# EasyEDA Pro project Dragon_Ball_Radar_3.eprj

# Schematic Schematic1

## Sheets
1 P1: Create Date: 2024-03-10; Page Name: P1; Project Name: Dragon_Ball_Radar_3; Schematic Name: Schematic1; Update Date: 2024-05-07; Company: 嘉立创EDA; Page Size: A4; Version: V1.0
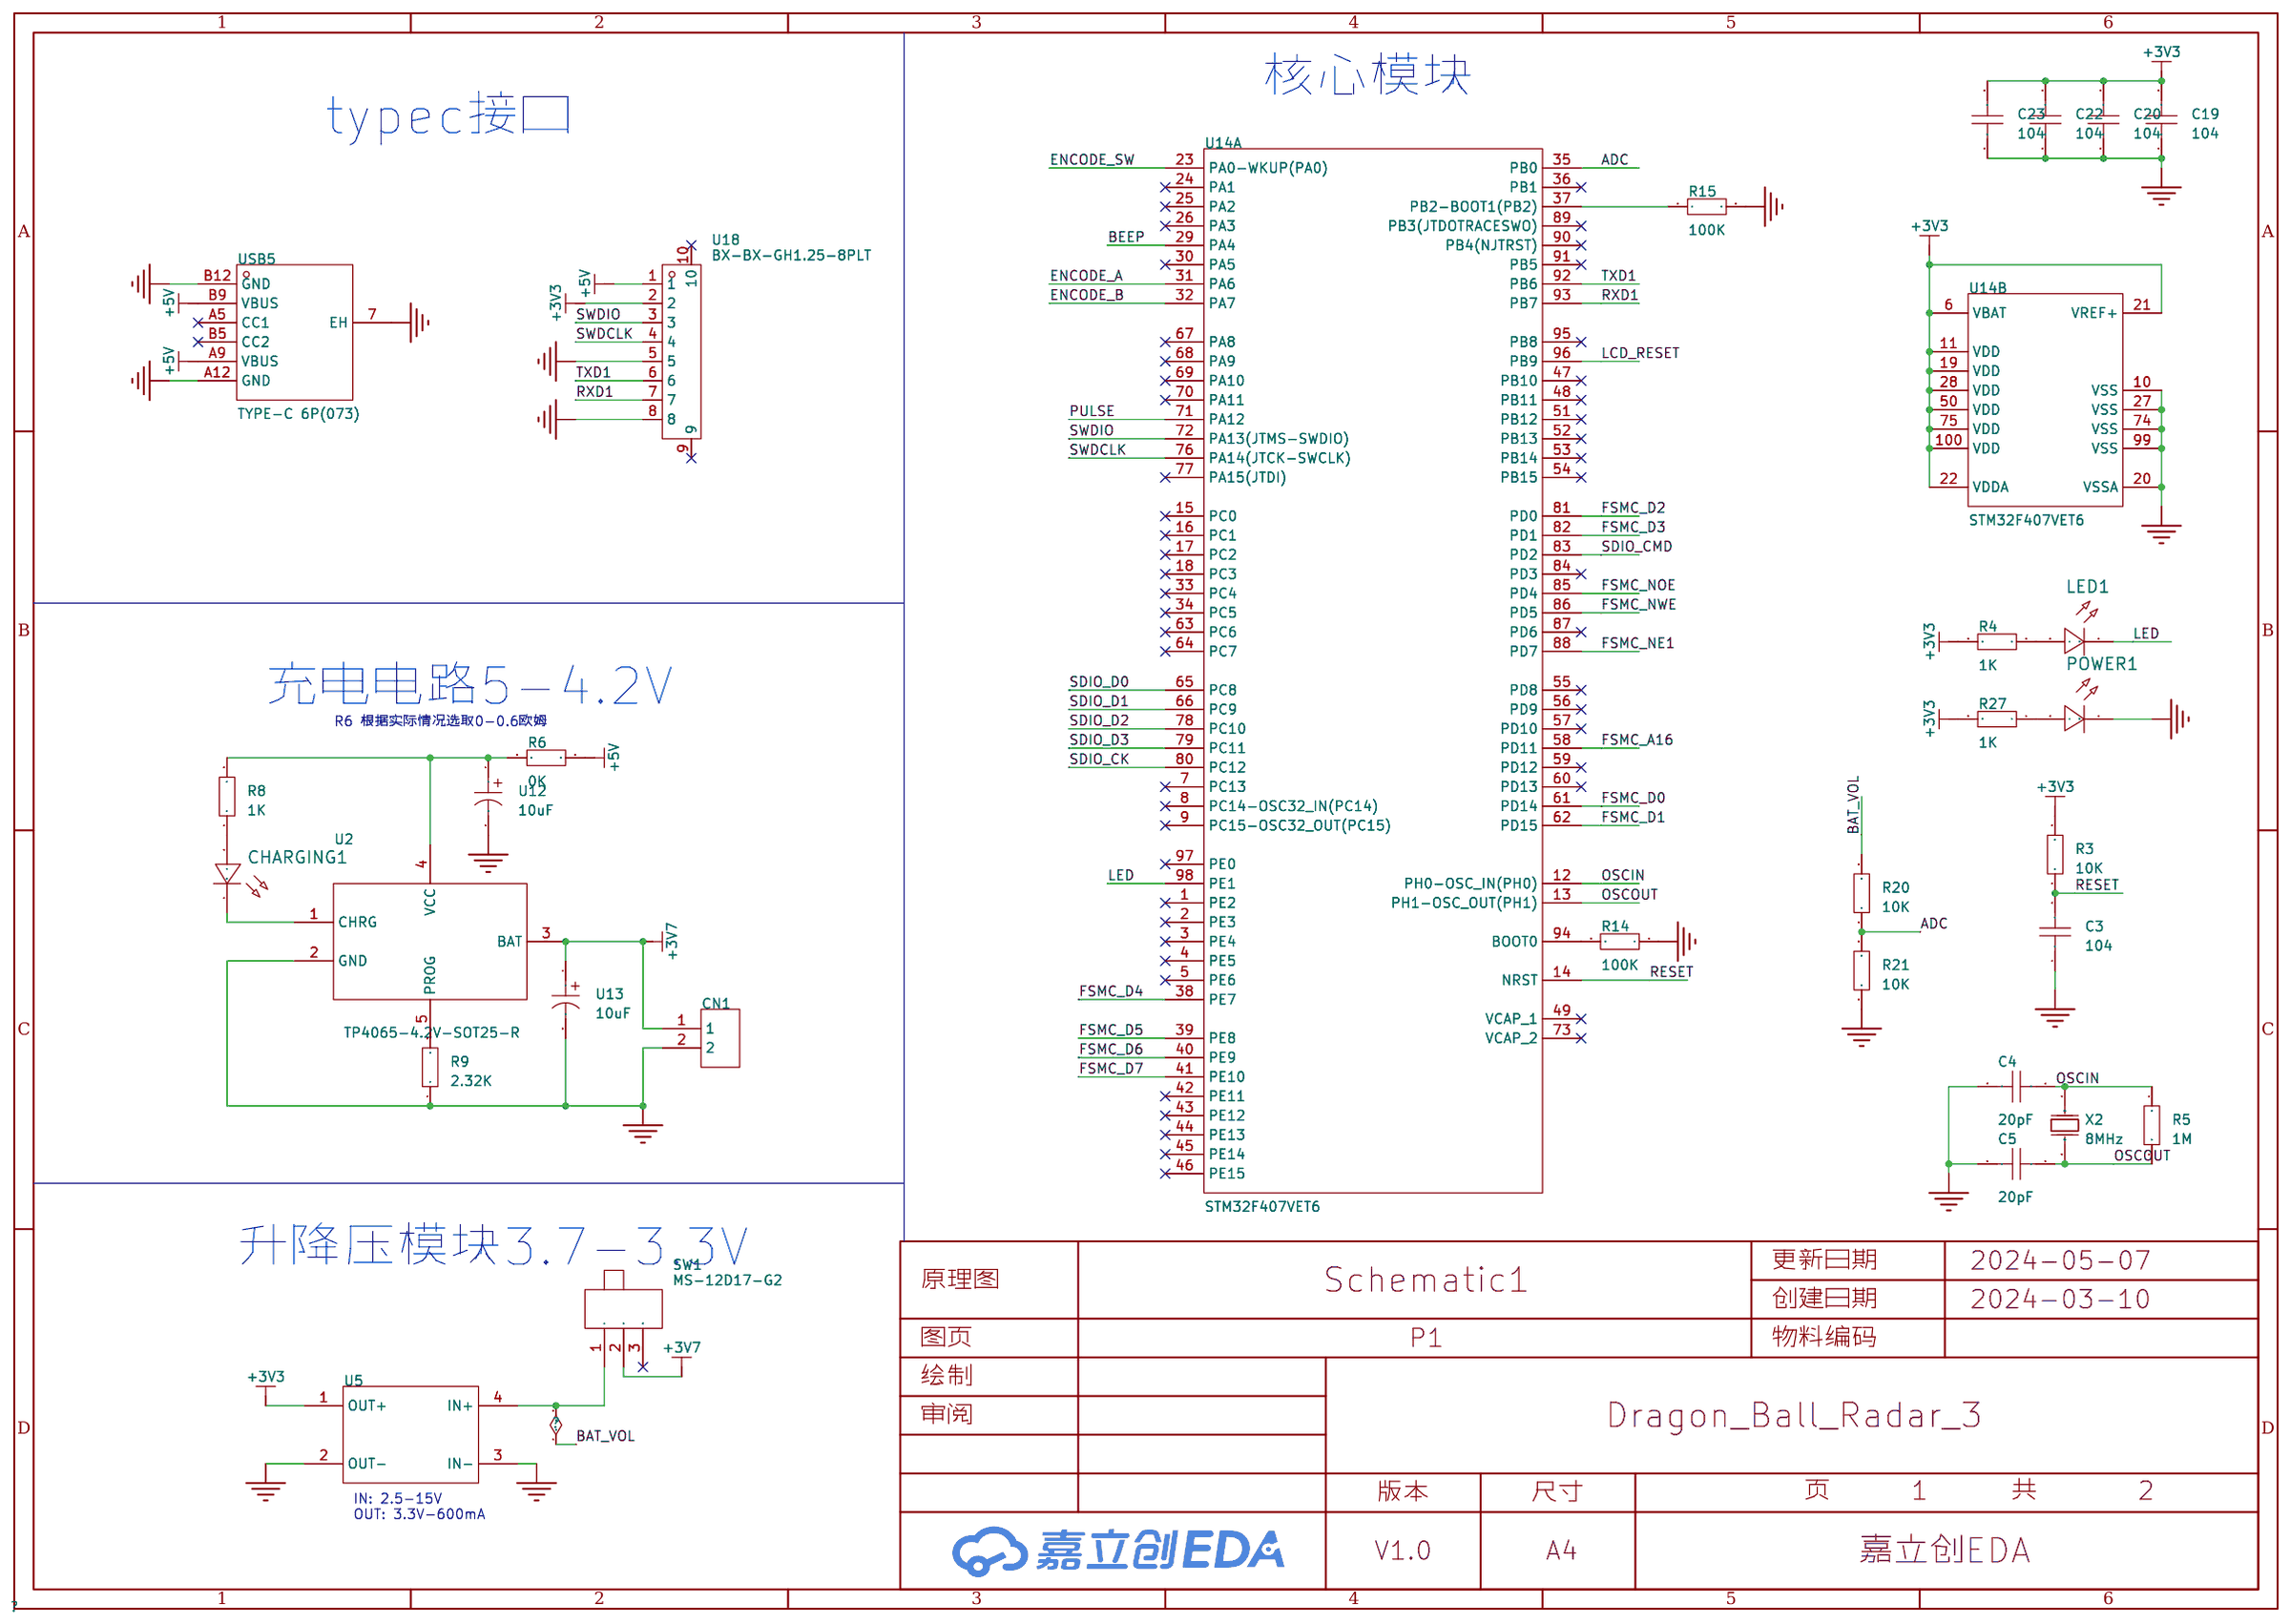
[diagram p0: P1]
2 P2: Create Date: 2024-03-26; Page Name: P2
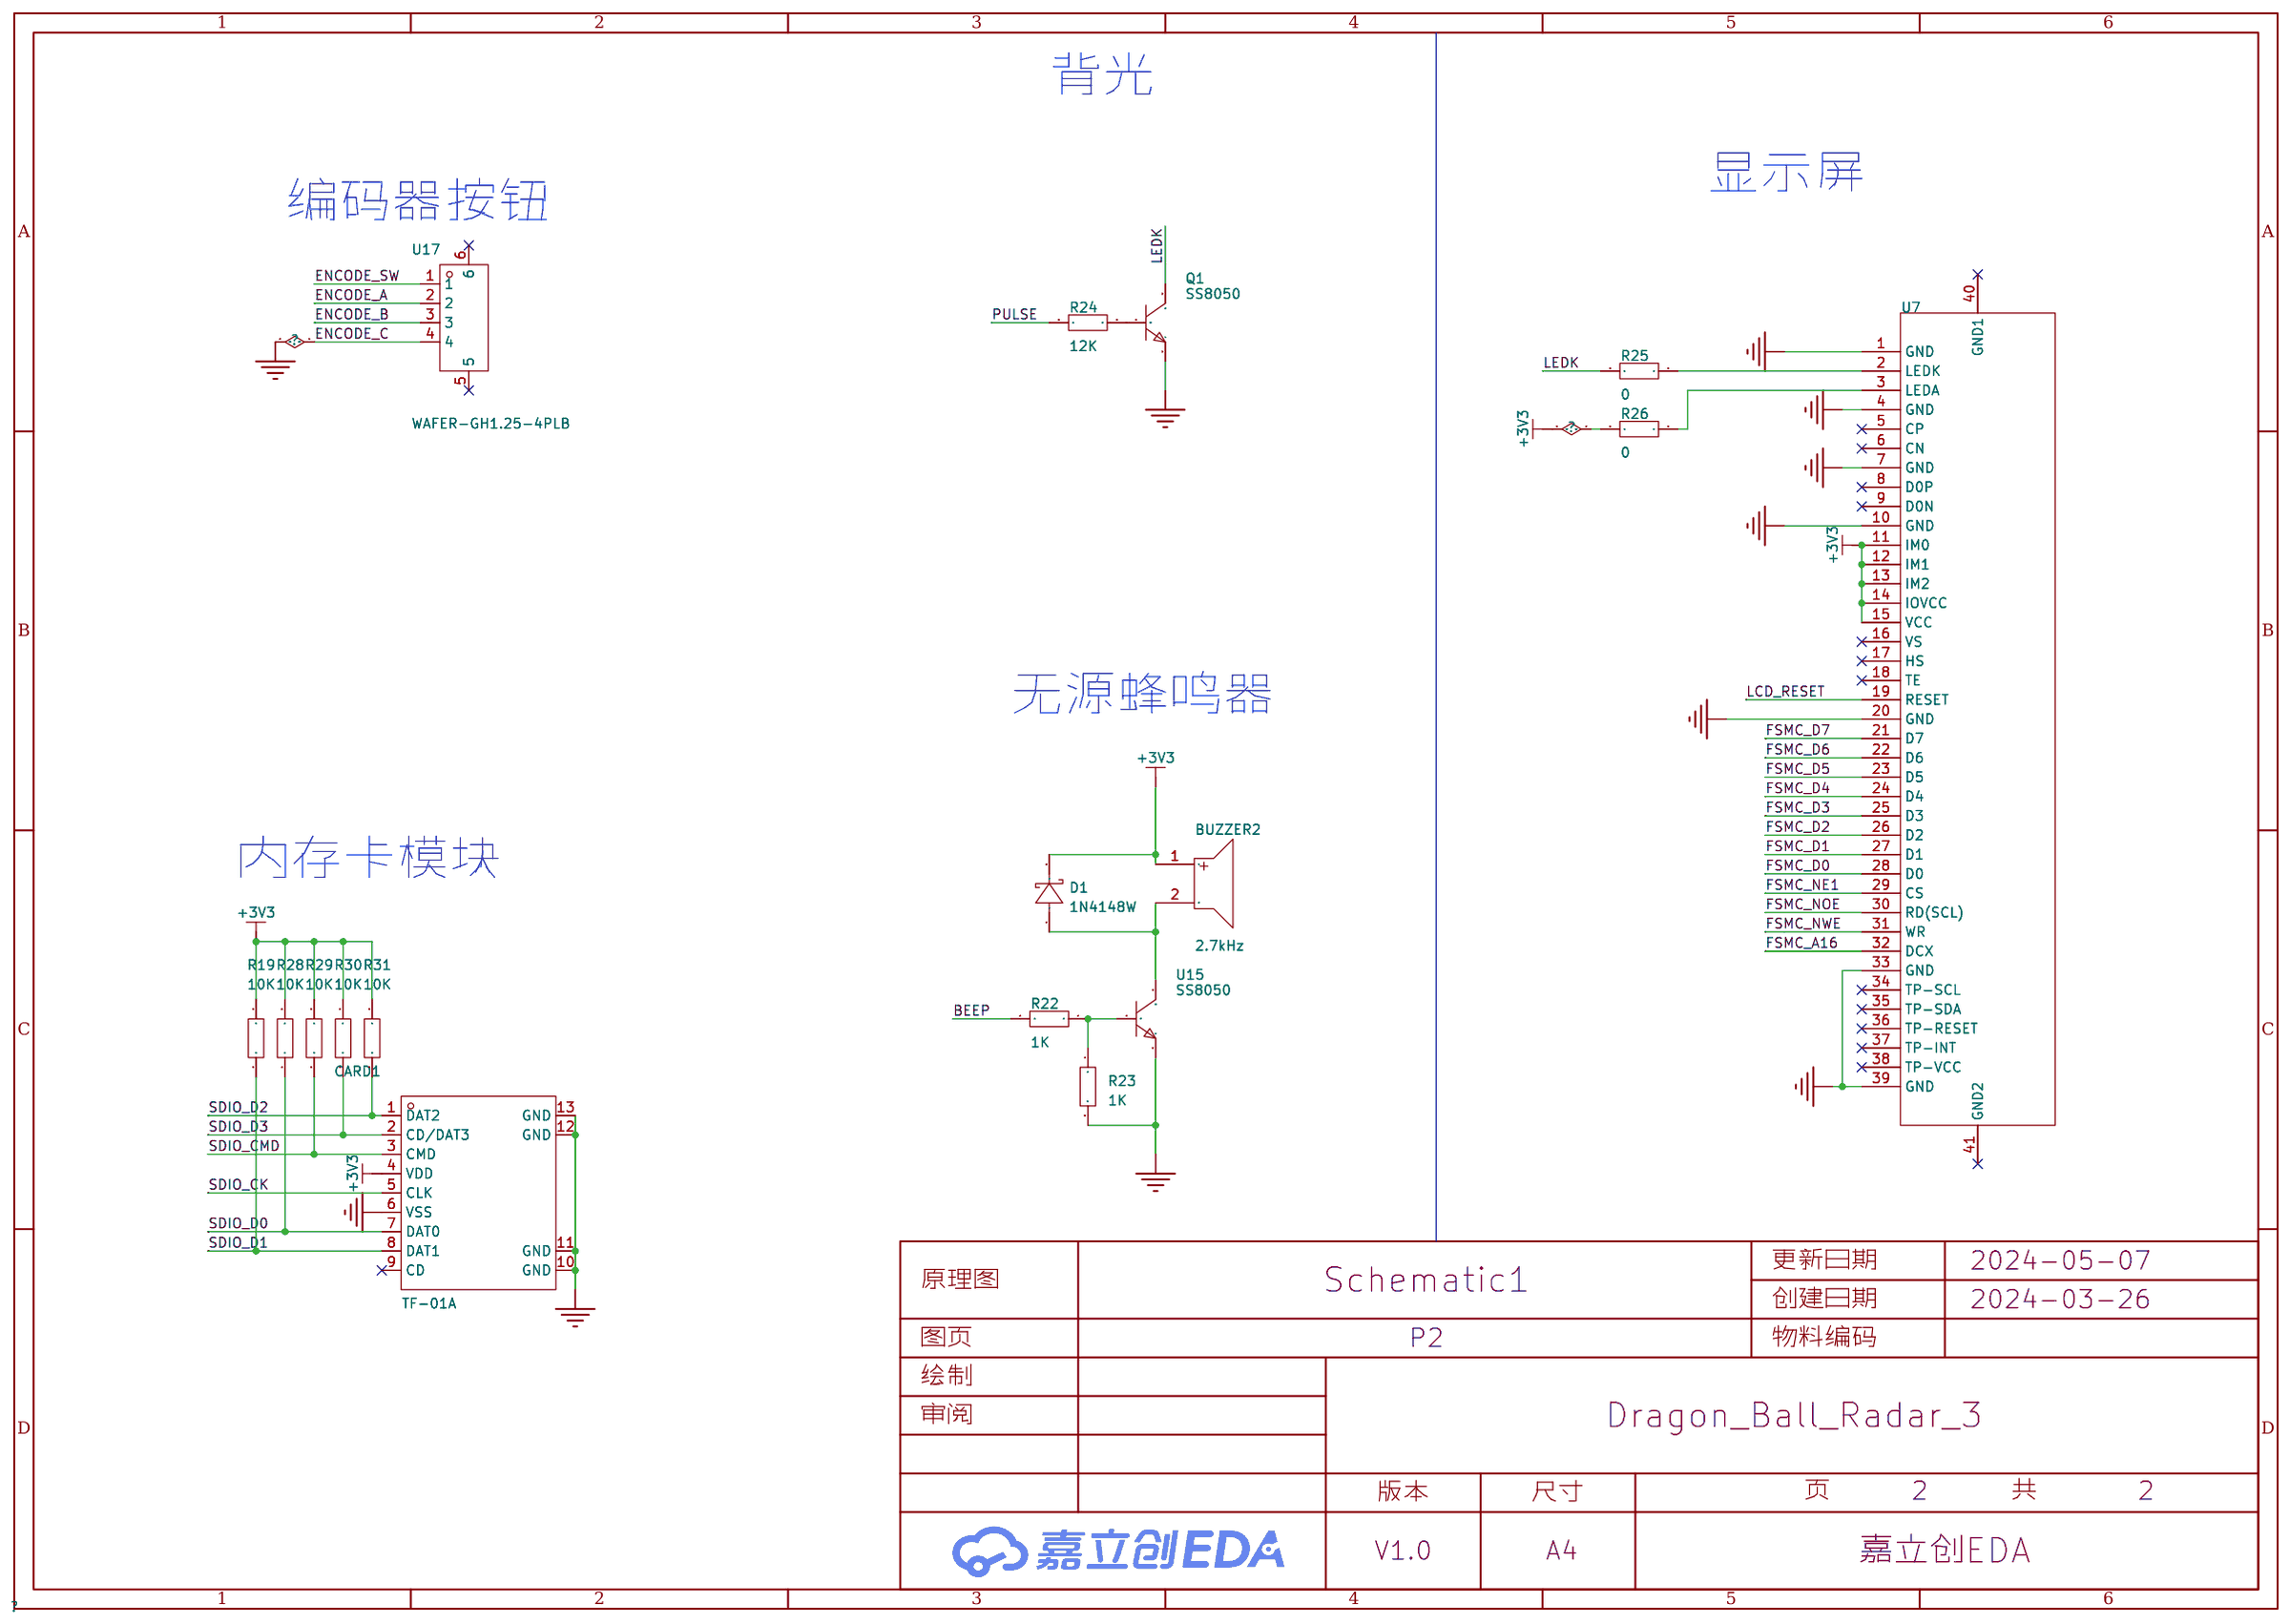
[diagram p1: P2]

## Parts
sheet P1
C3  104  [C0603]
C4  20pF  [C0603]
C5  20pF  [C0603]
C19  104  [C0603]
C20  104  [C0603]
C22  104  [C0603]
C23  104  [C0603]
CHARGING1  -  [LED_0603]
CN1  -  [pin2]
LED1  -  [LED_0603]
POWER1  -  [LED_0603]
R3  10K  [R0603]
R4  1K  [R0603]
R5  1M  [R0603]
R6  0K  [R0603]
R8  1K  [R0603]
R9  2.32K  [R0603]
R14  100K  [R0603]
R15  100K  [R0603]
R20  10K  [R0603]
R21  10K  [R0603]
R27  1K  [R0603]
SW1  MS-12D17-G2  [SW-SMD_3P-L9.1-W3.5-P2.50]
U2  TP4065-4.2V-SOT25-R  [SOT-23-5_L3.0-W1.7-P0.95-LS2.8-BR]
U5  -  [module_dc-dc]
U12  10uF  [CAP-SMD_BD4.0-L4.3-W4.3-LS5.0-FD]
U13  10uF  [CAP-SMD_BD4.0-L4.3-W4.3-LS5.0-FD]
U14  STM32F407VET6  [LQFP-100_L14.0-W14.0-P0.50-LS16.0-BL]  (sections 1,2)
U18  BX-BX-GH1.25-8PLT  [CONN-SMD_8P-P1.25_JS_GH125-S08CCA-00]
USB5  TYPE-C 6P(073)  [TYPE-C-SMD_TYPE-C-6P]
X2  8MHz  [CRYSTAL-SMD_L11.5-W4.8-LS12.7]
sheet P2
BUZZER2  2.7kHz  [BUZ-TH_BD9.0-P4.00-D0.6-FD]
CARD1  TF-01A  [TF-SMD_TF-02]
D1  1N4148W  [SOD-123_L2.7-W1.6-LS3.7-FD]
Q1  SS8050  [SOT-23-3_L2.9-W1.3-P1.90-LS2.4-BR]
R19  10K  [R0603]
R22  1K  [R0603]
R23  1K  [R0603]
R24  12K  [R0603]
R25  0  [R0603]
R26  0  [R0603]
R28  10K  [R0603]
R29  10K  [R0603]
R30  10K  [R0603]
R31  10K  [R0603]
U7  -  [39pin]
U15  SS8050  [SOT-23-3_L2.9-W1.3-P1.90-LS2.4-BR]
U17  WAFER-GH1.25-4PLB  [CONN-SMD_4P-P1.25_XUNPU_WAFER-GH1.25-4PLB]

## Library data of the parts
C3-C5 C19 C20 C22 C23 = CAP_0603: Supplier Footprint: 0603
CHARGING1 LED1 POWER1 = LED_0603-R: Supplier Footprint: 0603
CN1 = pin2
R3-R6 R8 R9 R14 R15 R19-R31 = Res_0603: Supplier Footprint: 0603
SW1 = MS-12D17-G2: 电路结构:单刀双掷;安装方式:立贴;开关颜色:黑色;机械寿命:-;; LCSC Part Name: 微型拨动开关; Supplier Part: C2904914; Manufacturer: DEALON(德艺隆); Supplier Footprint: SMD; JLCPCB Part Class: 扩展库; Datasheet: https://atta.szlcsc.com/upload/public/pdf/source/20211116/8958479B874C4A7AA0D8322A6B8A6226.pdf; Supplier: LCSC; Circuit: 单刀双掷; Actuator Style: 矩形柱状; Pin Style: 鸥翼型; Switch Length: 9.1mm; Switch Width: 3.5mm; Switch Height: 5.5mm; Mounting Style: 立贴; Actuator Color: 黑色
U2 = TP4065-4.2V-SOT25-R: 3mA-600mA 线性锂离子电池充电器; Supplier Part: C113540; Manufacturer: TOPPOWER(南京拓微); Supplier Footprint: SOT-23-5; JLCPCB Part Class: 扩展库; Datasheet: https://atta.szlcsc.com/upload/public/pdf/source/20170601/1496302453692.pdf; Supplier: LCSC
U5 = 升降压模块: 模块 https://item.taobao.com/item.htm?id=564801661674&spm=a1z0d.6639537/tb.1997196601.4.54df7484Fc7TCa
U12 U13 = VT10UF16V167RV0128: 容值:10uF;精度:±20%;额定电压:16V;纹波电流:18mA@120kHz;等效串联电阻:-;; LCSC Part Name: 10uF ±20% 16V; Supplier Part: C5246581; Manufacturer: KNSCHA(科尼盛); Supplier Footprint: SMD,D4xL5.4mm; JLCPCB Part Class: 扩展库; Datasheet: https://atta.szlcsc.com/upload/public/pdf/source/20221103/9F9BF07BB249386F3919A1DEC4ACBDCD.pdf; Supplier: LCSC; Tolerance: ±20%; Rated Voltage: 16V; Ripple Current: 18mA@120kHz; φD: 4mm; L: 5.4mm; Lifetime @ Temp: 2000hrs@105℃; Operating Temperature: -55℃~+105℃
U14 = STM32F407VET6: CPU内核:CM4;程序存储容量:512KB;RAM总容量:192KB;GPIO端口数量:82;工作电压范围:1.8V~3.6V;CPU最大主频:168MHz;程序存储器类型:FLASH;; Supplier Part: C28730; Manufacturer: ST(意法半导体); Supplier Footprint: LQFP-100(14x14); JLCPCB Part Class: 扩展库; Datasheet: https://atta.szlcsc.com/upload/public/pdf/source/20140801/1457707197138.pdf; Supplier: LCSC; CPU Core: CM4; Program Storage Size: 512KB; RAM Size: 192KB; GPIO Ports Number: 82; Operating Voltage Range: 1.8V~3.6V; CPU Maximum Speed: 168MHz; Program Memory Type: FLASH; Operating Temperature Range: -40℃~+85℃; ADC (Bit): 12bit; DAC (Bit): 12bit; Universal Serial Bus: 有; Peripheral/Function: DMA；LCD/LED驱动；PWM; Watchdog: 有; Infrared Data Association: 有; Low-Voltage Detect: 有; LCD Module: 有; Direct Memory Access: 有; Internal Oscillator: 有
U18 = BX-BX-GH1.25-8PLT: 插针结构:1x8P;间距:1.25mm;安装方式:立贴;参考系列:GH;总PIN数:8P;排数:1;每排PIN数:8;行距:-;额定电流:1A;触头材质:磷铜;触头镀层:锡;工作温度范围:-25℃~+85℃;; Supplier Part: C18077715; Manufacturer: Bossie(博锡); Supplier Footprint: SMD,P=1.25mm; JLCPCB Part Class: 扩展库; Datasheet: https://atta.szlcsc.com/upload/public/pdf/source/20231017/C586DA1185646CD749397F4D525889BE.pdf; Supplier: LCSC; Pins Structure: 1x8P; Pitch: 1.25mm; Mounting Style: 立贴; Reference Series: GH; Number of Pins: 8P; Number of Rows: 1; Number of PINs Per Row: 8; Current Rating (Max): 1A; Contact Material: 磷铜; Contact Plating: 锡; Operating Temperature Range: -25℃~+85℃
USB5 = TYPE-C 6P(073): 连接器类型:Type-C;标准:-;公母:母;端口数量:1;触点数量:6P;安装方式:卧贴;额定电流 - 电源:5A;工作温度范围:-25℃~+85℃;; LCSC Part Name: Type-C 母 卧贴; Supplier Part: C668623; Manufacturer: SHOU HAN(首韩); Supplier Footprint: SMD; JLCPCB Part Class: 扩展库; Datasheet: https://atta.szlcsc.com/upload/public/pdf/source/20200618/C668623_A4B260DED7AC1949BAC6AE39E9F4CD80.pdf; Supplier: LCSC; Connector Type: Type-C; Gender: 母; Number of Ports: 1; Number of Contacts: 6P; Mounting Style: 卧贴; Current Rating - Power (Max): 5A; Operating Temperature Range: -25℃~+85℃
X2 = X49SM8MSD2SC: 晶振类型:贴片晶振;频率:8MHz;常温频差:±20ppm;外接负载电容:20pF;频率稳定度(全温):±30ppm;; LCSC Part Name: 8MHz ±20ppm 20pF; Supplier Part: C12674; Manufacturer: YXC(扬兴晶振); Supplier Footprint: HC-49S-SMD; JLCPCB Part Class: 基础库; Datasheet: https://atta.szlcsc.com/upload/public/pdf/source/20210329/C106809_0E91E60850A780B284B63D653DC40EA4.pdf; Supplier: LCSC; Crystal Type: 贴片晶振; Normal temperature Frequency Tolerance: ±20ppm; External load capacitor: 20pF; Frequency Stability(Full temperature range): ±30ppm; Operating Temperature: -20℃~+70℃
BUZZER2 = QMB-09B-03: 驱动方式:无源(外部驱动);构造类型:电磁式;频率:2.7kHz;声压(SPL):85dB@3V,10cm;; LCSC Part Name: 无源蜂鸣器QMB-09B-03; Supplier Part: C96256; Manufacturer: 华能; Supplier Footprint: 插件,D=9mm; JLCPCB Part Class: 扩展库; Datasheet: https://atta.szlcsc.com/upload/public/pdf/source/20210401/C96256_958B17753B5AD7CBFBCFFC7C095B4484.pdf; Supplier: LCSC; Oscillator Circuit: 无源(外部驱动); Technology Type: 电磁式; Operating Voltage: 2V~5V; Sound Pressure Level (SPL): 85dB@3V,10cm; Diameter (φD): 9mm; Height: 5.7mm
CARD1 = TF-01A_C2889258: 卡连接方式:自弹式;卡类型:MicroSD卡(TF卡);连接器类型:卡座;本体最大高度:2mm;工作温度范围:-;; LCSC Part Name: 自弹式 MicroSD卡(TF卡) 卡座; Supplier Part: C2889258; Manufacturer: Yuandi(元迪); Supplier Footprint: SMD; JLCPCB Part Class: 扩展库; Datasheet: https://atta.szlcsc.com/upload/public/pdf/source/20210830/44259D2B93BF4B637A446EF1520C4989.pdf; Supplier: LCSC; Card Connection Mode: 自弹式; Card Type: MicroSD卡(TF卡); Connector Type: 卡座; Maximum Body Height: 2mm
D1 = 1N4148W_C7420318: 二极管配置:独立式;正向压降(Vf):1.25V@150mA;直流反向耐压(Vr):100V;平均整流电流(Io):150mA;功率:400mW;反向恢复时间(trr):4ns;; LCSC Part Name: 电压:100V 电流:150mA; Supplier Part: C7420318; Manufacturer: 宏迦橙; Supplier Footprint: SOD-123; JLCPCB Part Class: 扩展库; Datasheet: https://atta.szlcsc.com/upload/public/pdf/source/20230828/E5C3F7A4272052930A7E03B75759BF50.pdf; Supplier: LCSC; Diode Configuration: 独立式; Forward Voltage (Vf@If): 1.25V@150mA; Reverse Voltage (Vr): 100V; Average Rectified Current (Io): 150mA; Power Dissipation: 400mW; Reverse Leakage Current: 1uA@75V; Reverse Recovery Time (trr): 4ns; Operating Temperature: -55℃~+150℃
Q1 = SS8050_C2150: 晶体管类型:NPN;集电极电流(Ic):1.5A;集射极击穿电压(Vceo):25V;功率(Pd):300mW;直流电流增益(hFE@Ic,Vce):200@100mA,1V;; LCSC Part Name: SS8050(RANGE:200-350) hfe=200~350; Supplier Part: C2150; Manufacturer: CJ(江苏长电/长晶); Supplier Footprint: SOT-23; JLCPCB Part Class: 基础库; Datasheet: https://atta.szlcsc.com/upload/public/pdf/source/20230322/AEE86F4B043774EFF80CAEA14A37D9E9.pdf; Supplier: LCSC; Transistor Type: NPN; Collector Current (Ic): 1.5A; Collector-Emitter Breakdown Voltage (Vceo): 25V; Power Dissipation (Pd): 300mW; DC Current Gain (hFE@Ic,Vce): 200@100mA,1V; Transition Frequency (fT): 100MHz; Collector Cut-Off Current (Icbo): 100nA; Collector-Emitter Saturation Voltage (VCE(sat)@Ic,Ib): 500mV@800mA,80mA
U7 = 39pin: 39pin屏幕模块接口
U15 = SS8050_C7420370: 晶体管类型:NPN;集电极电流(Ic):1.5A;集射极击穿电压(Vceo):25V;功率(Pd):300mW;直流电流增益(hFE@Ic,Vce):120@100mA,1.0V;; LCSC Part Name: 耐压:25V 电流:1.5A NPN H档 200-350; Supplier Part: C7420370; Manufacturer: 宏迦橙; Supplier Footprint: SOT-23; JLCPCB Part Class: 扩展库; Datasheet: https://atta.szlcsc.com/upload/public/pdf/source/20231222/9C4050A7669EB24B3ACD0418218817FD.pdf; Supplier: LCSC; Transistor Type: NPN; Collector Current (Ic): 1.5A; Collector-Emitter Breakdown Voltage (Vceo): 25V; Power Dissipation (Pd): 300mW; DC Current Gain (hFE@Ic,Vce): 120@100mA,1.0V; Transition Frequency (fT): 100MHz; Collector Cut-Off Current (Icbo): 100nA; Collector-Emitter Saturation Voltage (VCE(sat)@Ic,Ib): 500mV@800mA,80mA; Operating Temperature: -55℃~+150℃
U17 = WAFER-GH1.25-4PLB: 插针结构:1x4P;间距:1.25mm;安装方式:立贴;参考系列:GH;总PIN数:4P;排数:1;每排PIN数:4;额定电流:1A;工作温度范围:-25℃~+85℃;; LCSC Part Name: 1x4P 间距:1.25mm 立贴 系列:GH; Supplier Part: C3029370; Manufacturer: XUNPU(讯普); Supplier Footprint: SMD,P=1.25mm; JLCPCB Part Class: 扩展库; Datasheet: https://atta.szlcsc.com/upload/public/pdf/source/20220527/44F824AAC8C2B617205E15955FF9C23D.pdf; Supplier: LCSC; Pins Structure: 1x4P; Pitch: 1.25mm; Mounting Style: 立贴; Reference Series: GH; Number of Pins: 4P; Number of Rows: 1; Number of PINs Per Row: 4; Current Rating (Max): 1A; Operating Temperature Range: -25℃~+85℃

## Nets
+3V3: BUZZER2.1 C19.2 C20.2 C22.2 C23.2 CARD1.4(VDD) D1.2(K) R3.2 R4.2 R19.2 R26.2 R27.2 R28.2 R29.2 R30.2 R31.2 U5.1(OUT+) U7.11(IM0) U7.12(IM1) U7.13(IM2) U7.14(IOVCC) U7.15(VCC) U14.6(VBAT) U14.11(VDD) U14.19(VDD) U14.21(VREF+) U14.22(VDDA) U14.28(VDD) U14.50(VDD) U14.75(VDD) U14.100(VDD) U18.2
+3V7: CN1.1 SW1.2 U2.3(BAT) U13.1
+5V: R6.1 U18.1 USB5.A9(VBUS) USB5.B9(VBUS)
GND: C3.1 C4.2 C5.2 C19.1 C20.1 C22.1 C23.1 CARD1.6(VSS) CARD1.10(GND) CARD1.11(GND) CARD1.12(GND) CARD1.13(GND) CN1.2 POWER1.1(C) Q1.2(E) R9.1 R14.1 R15.2 R21.1 R23.2 U2.2(GND) U5.2(OUT-) U5.3(IN-) U7.1(GND) U7.4(GND) U7.7(GND) U7.10(GND) U7.20(GND) U7.33(GND) U7.39(GND) U12.2 U13.2 U14.10(VSS) U14.20(VSSA) U14.27(VSS) U14.74(VSS) U14.99(VSS) U15.2(E) U17.4 U18.5 U18.8 USB5.7(EH) USB5.A12(GND) USB5.B12(GND)
ADC: R20.1 R21.2 U14.35(PB0)
BAT_VOL: R20.2 SW1.1 U5.4(IN+)
BEEP: R22.2 U14.29(PA4)
ENCODE_A: U14.31(PA6) U17.2
ENCODE_B: U14.32(PA7) U17.3
ENCODE_SW: U14.23(PA0-WKUP(PA0)) U17.1
FSMC_A16: U7.32(DCX) U14.58(PD11)
FSMC_D0: U7.28(D0) U14.61(PD14)
FSMC_D1: U7.27(D1) U14.62(PD15)
FSMC_D2: U7.26(D2) U14.81(PD0)
FSMC_D3: U7.25(D3) U14.82(PD1)
FSMC_D4: U7.24(D4) U14.38(PE7)
FSMC_D5: U7.23(D5) U14.39(PE8)
FSMC_D6: U7.22(D6) U14.40(PE9)
FSMC_D7: U7.21(D7) U14.41(PE10)
FSMC_NE1: U7.29(CS) U14.88(PD7)
FSMC_NOE: U7.30(RD(SCL)) U14.85(PD4)
FSMC_NWE: U7.31(WR) U14.86(PD5)
LCD_RESET: U7.19(RESET) U14.96(PB9)
LED: LED1.1(C) U14.98(PE1)
LEDK: Q1.3(C) R25.2
OSCIN: C4.1 R5.1 U14.12(PH0-OSC_IN(PH0)) X2.1(OSC1)
OSCOUT: C5.1 R5.2 U14.13(PH1-OSC_OUT(PH1)) X2.2(OSC2)
PULSE: R24.2 U14.71(PA12)
RESET: C3.2 R3.1 U14.14(NRST)
RXD1: U14.93(PB7) U18.7
SDIO_CK: CARD1.5(CLK) U14.80(PC12)
SDIO_CMD: CARD1.3(CMD) R29.1 U14.83(PD2)
SDIO_D0: CARD1.7(DAT0) R28.1 U14.65(PC8)
SDIO_D1: CARD1.8(DAT1) R19.1 U14.66(PC9)
SDIO_D2: CARD1.1(DAT2) R31.1 U14.78(PC10)
SDIO_D3: CARD1.2(CD/DAT3) R30.1 U14.79(PC11)
SWDCLK: U14.76(PA14(JTCK-SWCLK)) U18.4
SWDIO: U14.72(PA13(JTMS-SWDIO)) U18.3
TXD1: U14.92(PB6) U18.6
$1N1305: LED1.2(A) R4.1
$1N2733: CHARGING1.2(A) R8.1
$1N2766: CHARGING1.1(C) U2.1(CHRG)
$1N2908: R6.2 R8.2 U2.4(VCC) U12.1
$1N3037: R9.2 U2.5(PROG)
$1N19149: R14.2 U14.94(BOOT0)
$1N19191: R15.1 U14.37(PB2-BOOT1(PB2))
$1N25426: POWER1.2(A) R27.1
$2N2334: R25.1 U7.2(LEDK)
$2N7890: BUZZER2.2 D1.1(A) U15.3(C)
$2N7891: R22.1 R23.1 U15.1(B)
$2N9800: Q1.1(B) R24.1
$2N9887: R26.1 U7.3(LEDA)

Not connected (* = marked no-connect by the designer): CARD1 9(CD)*; SW1 3*; U7 5(CP)* 6(CN)* 8(D0P)* 9(D0N)* 16(VS)* 17(HS)* 18(TE)* 34(TP-SCL)* 35(TP-SDA)* 36(TP-RESET)* 37(TP-INT)* 38(TP-VCC)* 40(GND1)* 41(GND2)*; U14 1(PE2)* 2(PE3)* 3(PE4)* 4(PE5)* 5(PE6)* 7(PC13)* 8(PC14-OSC32_IN(PC14))* 9(PC15-OSC32_OUT(PC15))* 15(PC0)* 16(PC1)* 17(PC2)* 18(PC3)* 24(PA1)* 25(PA2)* 26(PA3)* 30(PA5)* 33(PC4)* 34(PC5)* 36(PB1)* 42(PE11)* 43(PE12)* 44(PE13)* 45(PE14)* 46(PE15)* 47(PB10)* 48(PB11)* 49(VCAP_1)* 51(PB12)* 52(PB13)* 53(PB14)* 54(PB15)* 55(PD8)* 56(PD9)* 57(PD10)* 59(PD12)* 60(PD13)* 63(PC6)* 64(PC7)* 67(PA8)* 68(PA9)* 69(PA10)* 70(PA11)* 73(VCAP_2)* 77(PA15(JTDI))* 84(PD3)* 87(PD6)* 89(PB3(JTDOTRACESWO))* 90(PB4(NJTRST))* 91(PB5)* 95(PB8)* 97(PE0)*; U17 5* 6*; U18 9* 10*; USB5 A5(CC1)* B5(CC2)*

## Notes on the sheets
sheet 1
- 核心模块
- typec接口
- 充电电路5-4.2V
- R6 根据实际情况选取0-0.6欧姆
- 升降压模块3.7-3.3V
- IN: 2.5-15V
  OUT: 3.3V-600mA
sheet 2
- 背光
- 显示屏
- 编码器按钮
- 无源蜂鸣器
- 内存卡模块

# Board PCB1
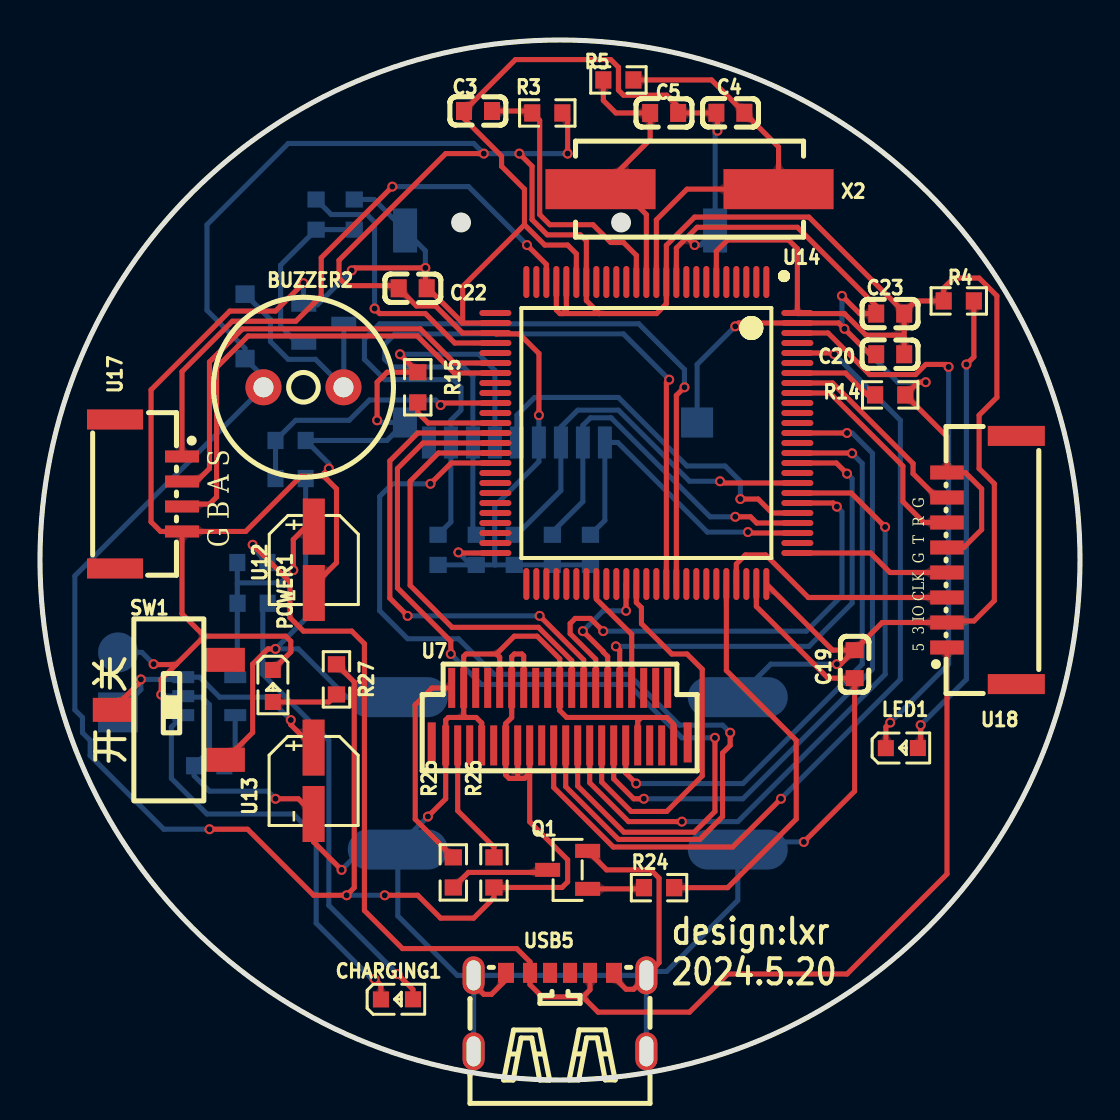
[diagram p2: board, top side]
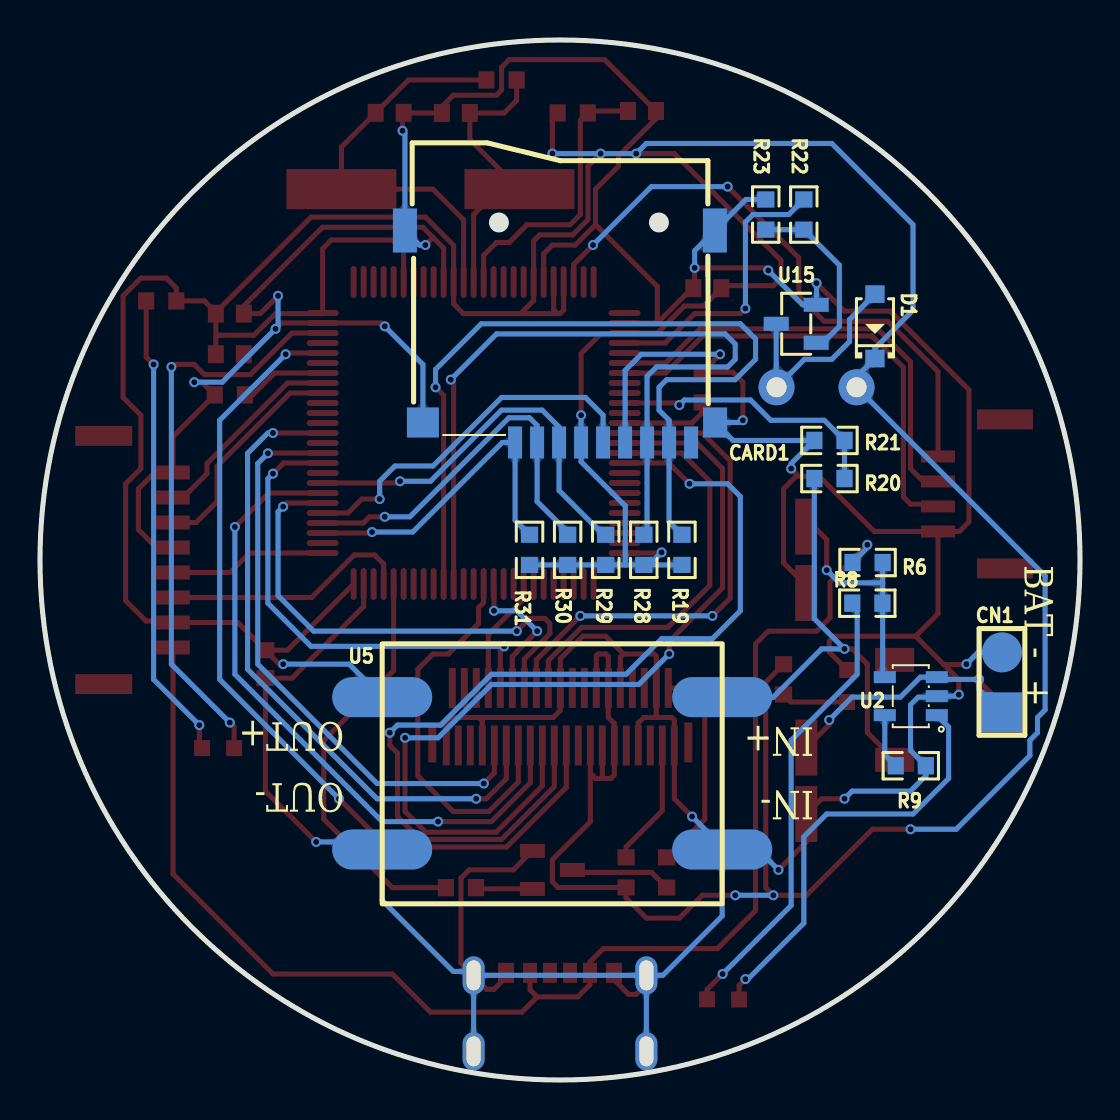
[diagram p3: board, bottom side, seen from below]

Outline 52 x 52 mm; copper layers: Top Layer, Bottom Layer. Coordinates in mm from the lower left corner of the outline.
Outline path: circle c26,26 r26
Stack: Top Layer 0.035mm / Dielectric1 1.51mm FR4 er 4.5 / Bottom Layer 0.035mm

## Design rules (mm)
template: JLCPCB Capability(Two Layers Board)
spacing copperThickness1oz (default): track to track 0.102, other pairs 0.152 to 0.3
spacing copperThickness2oz: track to track 0.203, other pairs 0.152 to 0.3
track width copperThickness1oz (default): min 0.127, default 0.254, max 2.54
track width copperThickness2oz: min 0.203, default 0.254, max 2.54
differential pair differentialPair (default): width min 0.127, default 0.254, max 2.54; gap min 0.152, default 0.152
via viaSize (default): diameter min 0.5, default 0.61, max 10; hole min 0.3, default 0.305, max 6.3

## Placement (name value [footprint] x y rotation side)
BUZZER2  2.7kHz  [BUZ-TH_BD9.0-P4.00-D0.6-FD]  13.17 34.64 0 top
C3  104  [C0603]  21.9 48.45 0 top
C4  20pF  [C0603]  34.52 48.36 180 top
C5  20pF  [C0603]  31.21 48.35 0 top
C19  104  [C0603]  40.73 20.79 90 top
C20  104  [C0603]  42.51 36.29 0 top
C22  104  [C0603]  18.63 39.59 180 top
C23  104  [C0603]  42.51 38.32 0 top
CARD1  TF-01A  [TF-SMD_TF-02]  26 37.18 0 bottom
CHARGING1  -  [LED_0603]  17.9 4.04 0 top
CN1  -  [pin2]  3.9 18.38 90 bottom
D1  1N4148W  [SOD-123_L2.7-W1.6-LS3.7-FD]  10.25 37.68 270 bottom
LED1  -  [LED_0603]  43.15 16.6 0 top
POWER1  -  [LED_0603]  11.65 19.65 270 top
Q1  SS8050  [SOT-23-3_L2.9-W1.3-P1.90-LS2.4-BR]  26.38 10.51 0 top
R3  10K  [R0603]  25.37 48.35 0 top
R4  1K  [R0603]  45.94 38.95 180 top
R5  1M  [R0603]  28.92 50 180 top
R6  0K  [R0603]  10.62 25.87 180 bottom
R8  1K  [R0603]  10.63 23.84 180 bottom
R9  2.32K  [R0603]  8.46 15.71 0 bottom
R14  100K  [R0603]  42.51 34.25 180 top
R15  100K  [R0603]  18.89 34.64 90 top
R19  10K  [R0603]  19.9 26.51 270 bottom
R20  10K  [R0603]  12.53 30.07 0 bottom
R21  10K  [R0603]  12.53 31.98 180 bottom
R22  1K  [R0603]  13.81 43.27 90 bottom
R23  1K  [R0603]  15.71 43.27 90 bottom
R24  12K  [R0603]  30.95 9.62 0 top
R25  0  [R0603]  20.67 10.38 270 top
R26  0  [R0603]  22.7 10.38 270 top
R27  1K  [R0603]  14.82 20.03 90 top
R28  10K  [R0603]  21.81 26.51 270 bottom
R29  10K  [R0603]  23.71 26.51 270 bottom
R30  10K  [R0603]  25.62 26.51 270 bottom
R31  10K  [R0603]  27.52 26.51 270 bottom
SW1  MS-12D17-G2  [SW-SMD_3P-L9.1-W3.5-P2.50]  6.44 18.51 90 top
U2  TP4065-4.2V-SOT25-R  [SOT-23-5_L3.0-W1.7-P0.95-LS2.8-BR]  8.46 19.19 180 bottom
U5  -  [module_dc-dc]  34.89 19.14 180 bottom
U7  -  [39pin]  20.28 16.73 0 top
U12  10uF  [CAP-SMD_BD4.0-L4.3-W4.3-LS5.0-FD]  13.69 26.01 270 top
U13  10uF  [CAP-SMD_BD4.0-L4.3-W4.3-LS5.0-FD]  13.68 14.96 270 top
U14  STM32F407VET6  [LQFP-100_L14.0-W14.0-P0.50-LS16.0-BL]  30.32 32.35 180 top
U15  SS8050  [SOT-23-3_L2.9-W1.3-P1.90-LS2.4-BR]  14.19 37.81 180 bottom
U17  WAFER-GH1.25-4PLB  [CONN-SMD_4P-P1.25_XUNPU_WAFER-GH1.25-4PLB]  5.43 29.3 270 top
U18  BX-BX-GH1.25-8PLT  [CONN-SMD_8P-P1.25_JS_GH125-S08CCA-00]  47.08 26 90 top
USB5  TYPE-C 6P(073)  [TYPE-C-SMD_TYPE-C-6P]  26 3.39 0 top
X2  8MHz  [CRYSTAL-SMD_L11.5-W4.8-LS12.7]  32.48 44.54 180 top

## Footprints (pads in the part's own frame, mm; a bottom-side part is the same pattern mirrored in y, then rotated)
39pin
  rect 0.35x2 smd: 1(0,0) 2(0.3,2.875) 3(0.6,0) 4(0.9,2.875) 5(1.2,0) 6(1.5,2.875) 7(1.8,0) 8(2.1,2.875) 9(2.4,0) 10(2.7,2.875) 11(3,0) 12(3.3,2.875) 13(3.6,0) 14(3.9,2.875) 15(4.2,0) 16(4.5,2.875) 17(4.8,0) 18(5.1,2.875) 19(5.4,0) 20(5.7,2.875) 21(6,0) 22(6.3,2.875) 23(6.6,0) 24(6.9,2.875) 25(7.2,0) 26(7.5,2.875) 27(7.8,0) 28(8.1,2.875) 29(8.4,0) 30(8.7,2.875) 31(9,0) 32(9.3,2.875) 33(9.6,0) 34(9.9,2.875) 35(10.2,0) 36(10.5,2.875) 37(10.8,0) 38(11.1,2.875) 39(11.4,0)
  rect 0.4x2 smd: 40(-0.7,0.15) 41(12.1,0.15)
BUZ-TH_BD9.0-P4.00-D0.6-FD
  round 1.8 hole 1: 1(-2,0) 2(2,0)
C0603
  rect 0.8x0.9 smd: 1(-0.7,0) 2(0.7,0)
CAP-SMD_BD4.0-L4.3-W4.3-LS5.0-FD
  rect 2.8x1.1 smd: 1(-1.661,0) 2(1.661,0)
CONN-SMD_4P-P1.25_XUNPU_WAFER-GH1.25-4PLB
  rect 0.6x1.7 smd: 1(-1.875,1.675) 2(-0.625,1.675) 3(0.625,1.675) 4(1.875,1.675)
  rect 1x2.8 smd: 5(-3.725,-1.675) 6(3.725,-1.675)
CONN-SMD_8P-P1.25_JS_GH125-S08CCA-00
  rect 0.7x1.68 smd: 1(-4.375,1.732) 2(-3.125,1.732) 3(-1.875,1.732) 4(-0.625,1.732) 5(0.625,1.732) 6(1.875,1.732) 7(3.125,1.732) 8(4.375,1.732)
  rect 1x2.85 smd: 9(6.205,-1.732) 10(-6.205,-1.732)
CRYSTAL-SMD_L11.5-W4.8-LS12.7
  rect 5.5x2 smd: 1(-4.45,0) 2(4.45,0)
LED_0603
  rect 0.8x0.8 smd: 1(-0.851,-0.01) 2(0.75,-0.005)
LQFP-100_L14.0-W14.0-P0.50-LS16.0-BL
  oval 0.3x1.6 smd: 1(-6,-7.55) 2(-5.5,-7.55) 3(-5,-7.55) 4(-4.5,-7.55) 5(-4,-7.55) 6(-3.5,-7.55) 7(-3,-7.55) 8(-2.5,-7.55) 9(-2,-7.55) 10(-1.5,-7.55) 11(-1,-7.55) 12(-0.5,-7.55) 13(0,-7.55) 14(0.5,-7.55) 15(1,-7.55) 16(1.5,-7.55) 17(2,-7.55) 18(2.5,-7.55) 19(3,-7.55) 20(3.5,-7.55) 21(4,-7.55) 22(4.5,-7.55) 23(5,-7.55) 24(5.5,-7.55) 25(6,-7.55) 51(6,7.55) 52(5.5,7.55) 53(5,7.55) 54(4.5,7.55) 55(4,7.55) 56(3.5,7.55) 57(3,7.55) 58(2.5,7.55) 59(2,7.55) 60(1.5,7.55) 61(1,7.55) 62(0.5,7.55) 63(0,7.55) 64(-0.5,7.55) 65(-1,7.55) 66(-1.5,7.55) 67(-2,7.55) 68(-2.5,7.55) 69(-3,7.55) 70(-3.5,7.55) 71(-4,7.55) 72(-4.5,7.55) 73(-5,7.55) 74(-5.5,7.55) 75(-6,7.55)
  oval 1.6x0.3 smd: 26(7.55,-6) 27(7.55,-5.5) 28(7.55,-5) 29(7.55,-4.5) 30(7.55,-4) 31(7.55,-3.5) 32(7.55,-3) 33(7.55,-2.5) 34(7.55,-2) 35(7.55,-1.5) 36(7.55,-1) 37(7.55,-0.5) 38(7.55,0) 39(7.55,0.5) 40(7.55,1) 41(7.55,1.5) 42(7.55,2) 43(7.55,2.5) 44(7.55,3) 45(7.55,3.5) 46(7.55,4) 47(7.55,4.5) 48(7.55,5) 49(7.55,5.5) 50(7.55,6) 76(-7.55,6) 77(-7.55,5.5) 78(-7.55,5) 79(-7.55,4.5) 80(-7.55,4) 81(-7.55,3.5) 82(-7.55,3) 83(-7.55,2.5) 84(-7.55,2) 85(-7.55,1.5) 86(-7.55,1) 87(-7.55,0.5) 88(-7.55,0) 89(-7.55,-0.5) 90(-7.55,-1) 91(-7.55,-1.5) 92(-7.55,-2) 93(-7.55,-2.5) 94(-7.55,-3) 95(-7.55,-3.5) 96(-7.55,-4) 97(-7.55,-4.5) 98(-7.55,-5) 99(-7.55,-5.5) 100(-7.55,-6)
module_dc-dc
  oval 5x2 smd: 1(0,0) 2(0,-7.62) 3(17,-7.62) 4(17,0)
pin2
  rect 2x2 smd: 1(0,0)
  round 2 smd: 2(3,0)
R0603
  rect 0.806x0.864 smd: 1(-0.753,0) 2(0.753,0)
SOD-123_L2.7-W1.6-LS3.7-FD
  rect 0.88x0.96 smd: 1(-1.61,0) 2(1.61,0)
SOT-23-3_L2.9-W1.3-P1.90-LS2.4-BR
  rect 1.25x0.7 smd: 1(1,-0.95) 2(1,0.95) 3(-1,0)
SOT-23-5_L3.0-W1.7-P0.95-LS2.8-BR
  rect 1.1x0.6 smd: 1(1.3,-0.95) 2(1.3,0) 3(1.3,0.95) 4(-1.3,0.95) 5(-1.3,-0.95)
SW-SMD_3P-L9.1-W3.5-P2.50
  rect 1.2x1.95 smd: 1(-2.5,-2.825) 2(0,2.825) 3(2.5,-2.825)
TF-SMD_TF-02
  rect 0.7x1.6 smd: 1(2.245,5.3) 2(1.145,5.3) 3(0.046,5.3) 4(-1.054,5.3) 5(-2.155,5.3) 6(-3.255,5.3) 7(-4.354,5.3) 8(-5.454,5.3) 9(-6.554,5.3)
  rect 1.2x1.5 smd: 10(-7.754,4.3)
  rect 1.2x2.2 smd: 11(-7.746,-5.3) 12(7.754,-5.3)
  rect 1.6x1.5 smd: 13(6.854,4.3)
TYPE-C-SMD_TYPE-C-6P
  oval 1.1x1.9 hole 0.7x1.5: 7(-4.32,1.837) 7(-4.32,-1.962) 7(4.32,1.837) 7(4.32,-1.962)
  rect 0.7x1 smd: A5(-0.5,1.962) A9(1.5,1.962) B5(0.5,1.962) B9(-1.5,1.962)
  rect 0.8x1 smd: A12(2.7,1.962) B12(-2.7,1.962)

## Nets
As in the schematic.

Pads without a net: CARD1 9; SW1 3; U7 5 6 8 9 16 17 18 34 35 36 37 38 40 41; U14 1 2 3 4 5 7 8 9 15 16 17 18 24 25 26 30 33 34 36 42 43 44 45 46 47 48 49 51 52 53 54 55 56 57 59 60 63 64 67 68 69 70 73 77 84 87 89 90 91 95 97; U17 5 6; U18 9 10; USB5 A5 B5

## Via types
v1: diameter 0.5, hole 0.3, Top Layer to Bottom Layer, 68 vias
v2: diameter 0.61, hole 0.305, Top Layer to Bottom Layer, 2 vias

## Routing (per net, layer and track width the routed paths; a pad name or vN(x,y) marks a point on that pad's centre or on a via; arc(x,y) is an arc through that point)
+3V3: length 253.7
  Top Layer w0.254: U14.22 25.82,38.5 26,38.32 26.13,38.32 ; v1(22.19,46.32) 20.28,46.32 14.95,40.99 14.95,40.1 15.33,39.72 17.81,39.72 C22.2 18.82,38.7 19.78,38.7 21.13,37.35 U14.28 22.81,37.3 23.97,37.3 24.95,36.33 v1(24.95,33.24) ; U14.75 39.62,21.49 40.73,21.49 ; v1(8.47,12.54) 10.38,12.54 13.68,9.24 v1(15.33,9.24) 15.71,9.62 15.71,19.9 R27.2 ; 26.13,38.32 26.32,38.51 U14.21 ; 26.13,38.32 27.97,38.32 ; 40.73,21.49 40.03,20.79 v1(39.84,20.79) ; 40.73,21.49 42.11,22.88 U18.2 45.43,22.95 46.7,22.95 47.72,23.97 47.72,29.81 46.96,30.57 46.96,33.24 47.84,34.13 47.84,39.21 46.96,40.1 45.69,40.1 45.19,39.6 R4.2 43.78,38.95 43.21,38.38 ; v1(20.92,26.38) 20.95,26.35 U14.50 ; 27.97,38.32 30.83,38.32 31.32,38.81 U14.11 31.32,41.73 32.73,43.14 38.45,43.14 43.21,38.38 ; 27.97,38.32 27.32,38.97 U14.19 27.32,41.95 27.02,42.26 25.37,42.26 24.6,43.02 24.6,45.69 v1(23.97,46.32) ; 23.87,15.08 23.46,15.08 23.28,15.25 U7.11 23.28,17.82 23.59,18.12 U7.12 23.59,21.17 23.71,21.3 24.09,21.3 24.19,21.21 U7.14 ; 23.87,15.08 23.88,15.09 U7.13 ; 23.87,15.08 24.22,15.08 24.49,15.34 ; 43.21,37.11 C23.2 43.21,38.38 ; 43.21,37.11 43.08,37.24 41.31,37.24 40.22,38.32 37.9,38.32 U14.100 37.87,41.56 37.43,42 34.38,42 33.82,41.44 U14.6 ; 43.21,37.11 C20.2 ; v1(17.24,9.24) 18.89,9.24 20.03,8.09 21.68,8.09 22.7,9.11 R26.2 26.1,9.63 26.38,9.91 26.38,11.01 24.49,12.91 24.49,15.34 ; 24.49,15.34 U7.15 ; v1(26.38,46.32) 26.38,48.09 R3.2
  Bottom Layer w0.254: R19.2 21.55,25.75 ; 21.55,25.75 R28.2 22.73,25.75 ; 21.55,25.75 v1(20.92,26.38) ; v1(17.24,9.24) v1(15.33,9.24) ; R31.2 R30.2 R29.2 22.73,25.75 ; 22.73,25.75 22.73,28.7 24.95,30.91 CARD1.4 v1(24.95,33.24) ; v1(8.47,12.54) 6.19,12.54 2.5,16.22 2.5,16.98 2.12,17.36 2.12,18.13 1.74,18.51 1.74,25.21 BUZZER2.1 11.17,35.15 D1.2 10.25,36.58 8.35,38.49 8.35,42.76 12.41,46.83 21.68,46.83 v1(22.19,46.32) v1(23.97,46.32) v1(26.38,46.32) ; U5.1 36.54,20.79 v1(39.84,20.79)
+3V7: length 14.5
  Top Layer w0.254: U13.1 12.54,17.76 v1(12.54,18) ; SW1.2 5.04,19.94 v1(5.04,20.03)
  Bottom Layer w0.254: CN1.1 5.04,19.52 v1(5.04,20.03) 7.05,20.03 U2.3 7.98,20.14 8.98,19.14 11.4,19.14 v1(12.54,18)
+5V: length 70.6
  Top Layer w0.254: 27.14,4.16 27.5,4.51 USB5.A9 ; 27.14,4.16 27.91,3.39 32.48,3.39 34.38,5.3 40.35,5.3 45.35,10.3 U18.1 ; 27.14,4.16 25.11,4.16 24.5,4.77 USB5.B9 24.5,5.91 23.84,6.57 18.13,6.57 16.22,8.47 16.22,21.81 15.59,22.44 13.17,22.44 12.5,23.12 12.5,24.9 v1(10.63,26.76)
  Bottom Layer w0.254: R6.1 10.63,26.61 v1(10.63,26.76)
GND: length 303.2
  Top Layer w0.254: 24.22,42.76 25.24,41.75 26.38,41.75 26.82,41.31 U14.20 ; 24.22,42.76 21.13,39.68 21.13,37.85 ; 24.22,42.76 24.22,44.54 23.08,45.69 23.08,46.19 21.2,48.07 C3.1 23.77,51.02 28.54,51.02 28.92,50.64 28.92,49.5 29.18,49.24 31.33,49.24 31.91,48.67 31.91,48.35 33.81,48.35 C4.2 33.87,48.31 v1(33.87,47.46) ; U7.7 22.09,17.85 21.81,18.13 21.3,18.13 ; Q1.2 28.33,10.51 30.54,10.51 30.95,10.09 30.95,5.86 USB5.7 v2(30.32,5.17) 29.68,4.54 29.3,4.54 28.7,5.14 USB5.A12 ; v1(13.17,39.84) 11.78,38.45 9.49,38.45 5.55,34.51 5.55,27.91 6.03,27.43 U17.4 ; 8.22,22.19 7.1,23.31 U17.4 ; 8.22,22.19 6.8,20.77 ; 8.22,22.19 12.28,22.19 12.54,21.94 12.54,21.4 POWER1.1 ; v1(5.68,20.79) 5.7,20.77 6.8,20.77 ; USB5.B12 23.3,5.01 22.57,4.28 22.19,4.28 v2(21.68,4.79) USB5.7 ; 30.06,18.13 31.33,18.13 31.69,17.78 U7.39 ; 30.06,18.13 29.88,17.95 U7.33 ; 30.06,18.13 26.34,18.13 25.99,18.48 U7.20 25.99,21.06 24.86,22.19 23.71,22.19 22.82,21.3 ; 21.3,18.13 21.19,18.24 U7.4 21.19,21.19 21.3,21.3 22.82,21.3 ; 21.3,18.13 20.41,18.13 20.28,18 U7.1 20.28,14.06 v1(19.4,13.17) ; v1(40.1,39.21) 40.99,38.32 C23.1 41.81,38.7 37.87,42.64 32.86,42.64 32.34,42.12 ; 14.19,30.19 14.82,29.56 14.82,25.86 13.69,24.73 U12.2 ; 14.19,30.19 14.19,30.32 v1(14.44,30.57) ; 14.19,30.19 13.05,30.19 10.28,27.43 U17.4 ; 22.82,21.3 22.99,21.14 U7.10 ; v1(32.73,41.75) 32.36,42.12 32.34,42.12 ; v1(6.06,19.27) 6.06,20.03 6.8,20.77 ; v1(15.08,10.51) 13.68,11.9 U13.2 12.92,14.06 v1(11.78,14.06) ; v1(34.76,37.68) 34.93,37.85 U14.99 39.93,37.85 v1(40.22,37.56) 41.49,36.29 C20.1 ; U14.27 21.13,37.85 ; 21.13,37.85 19.4,39.59 C22.1 19.27,39.65 v1(19.27,40.61) 15.71,40.61 v1(15.59,40.48) ; 32.34,42.12 31.82,41.6 U14.10 ; U18.5 46.18,26.62 47.08,27.52 47.08,29.56 46.26,30.38 U18.8 45.35,32.17 R14.1 43.27,34.25 43.91,34.89 v1(44.29,34.89) ; v1(16.86,32.98) 16.86,34.89 17.36,35.39 R15.2 18,36.28 v1(18,36.29) ; v1(38.19,11.9) 40.73,14.44 C19.1 39.4,20.09 35.82,23.67 U14.74
  Bottom Layer w0.254: U5.3 17.89,11.67 v1(19.4,13.17) ; U5.3 17.89,8.2 20.86,5.23 USB5.7 USB5.7 30.51,5.43 31.33,5.43 34.89,8.98 U5.2 35.27,11.9 v1(38.19,11.9) ; U5.3 16.09,11.52 v1(15.08,10.51) ; CN1.2 5.09,21.38 v1(5.68,20.79) ; v1(44.29,34.89) 42.89,34.89 v1(40.22,37.56) 40.1,37.68 v1(40.1,39.21) ; v1(14.44,30.57) 14.44,30.82 13.28,31.98 17.35,31.98 CARD1.10 16.97,32.88 v1(16.86,32.98) ; v2(21.68,4.79) USB5.7 ; v1(33.87,47.46) 33.75,47.34 CARD1.12 33.03,41.75 v1(32.73,41.75) ; CARD1.13 32.85,35.78 v1(34.76,37.68) ; v1(11.78,14.06) 11.4,14.44 8.47,14.44 7.71,15.21 R9.1 8.47,16.48 8.47,18.76 8.09,19.14 7.21,19.14 U2.2 6.14,19.19 v1(6.06,19.27) ; v2(30.32,5.17) USB5.7 ; R23.2 16.7,44.03 CARD1.11 19.27,41.46 v1(19.27,40.61) ; v1(13.17,39.84) 13.17,38.78 13.19,38.76 13.87,38.76 v1(15.59,40.48) ; v1(18,36.29) 21.94,36.29 22.75,35.48 CARD1.6
ADC: length 13.9
  Top Layer w0.254: v1(20.03,33.75) 20.13,33.85 U14.35
  Bottom Layer w0.254: v1(20.03,33.75) 19.78,34 16.47,34 15.46,32.98 12.78,32.98 R21.2 R20.1
BAT_VOL: length 23.1
  Top Layer w0.254: v1(11.78,21.56) 11.4,21.56 10.63,20.79 10.63,17.37 SW1.1
  Bottom Layer w0.254: U5.4 15.33,19.14 12.92,21.56 v1(11.78,21.56) 13.28,23.06 13.28,30.07
BEEP: length 14.5
  Top Layer w0.254: v1(16.73,38.57) 16.98,38.32 19.27,38.32 20.74,36.85 U14.29
  Bottom Layer w0.254: R22.2 14.56,43.27 16.35,43.27 16.73,42.89 v1(16.73,38.57)
ENCODE_A: length 22.7
  Top Layer w0.254: U17.2 7.83,29.93 8.47,30.57 8.47,35.91 10.12,37.56 19.01,37.56 20.72,35.85 U14.31
ENCODE_B: length 23.8
  Top Layer w0.254: U14.32 20.71,35.35 18.86,37.2 10.4,37.2 8.83,35.63 8.83,29.15 8.47,28.79 7.22,28.79 U17.3
ENCODE_SW: length 29.9
  Top Layer w0.254: v1(17.62,44.67) 14.06,41.11 14.06,39.21 12.79,37.94 9.62,37.94 7.1,35.42 U17.1 ; v1(24.35,41.75) 25.32,40.78 U14.23
  Bottom Layer w0.254: v1(17.62,44.67) 21.43,44.67 v1(24.35,41.75)
FSMC_A16: length 5.9
  Top Layer w0.254: U7.32 29.59,22.28 27.82,24.04 U14.58
FSMC_D0: length 7.3
  Top Layer w0.254: U14.61 29.3,24.78 v1(29.3,23.46) ; v1(27.14,22.44) 28.16,21.43 28.16,21.4 28.38,21.17 U7.28
  Bottom Layer w0.254: v1(29.3,23.46) 28.16,23.46 v1(27.14,22.44)
FSMC_D1: length 19.6
  Top Layer w0.254: U14.62 29.82,23.87 30.07,23.62 30.07,22.82 31.59,21.3 32.35,21.3 33.11,20.54 33.11,15.2 31.33,13.43 29.56,13.43 28.09,14.9 U7.27
FSMC_D2: length 25
  Top Layer w0.254: v1(28.16,22.44) 27.52,23.08 26.76,23.08 26.51,22.83 26.51,22.32 27.78,21.04 U7.26 ; v1(39.84,28.67) 39.66,28.85 U14.81
  Bottom Layer w0.254: v1(28.16,22.44) 38.32,22.44 40.1,24.22 40.1,28.41 v1(39.84,28.67)
FSMC_D3: length 33
  Top Layer w0.254: v1(32.1,12.92) 29.43,12.92 27.49,14.86 U7.25 ; v1(42.26,27.65) 40.56,29.35 U14.82
  Bottom Layer w0.254: v1(42.26,27.65) 42.26,20.28 34.89,12.92 v1(32.1,12.92)
FSMC_D4: length 25.1
  Top Layer w0.254: U7.24 27.19,21 v1(24.98,23.21) ; U14.38 18.89,32.35 17.49,30.95 17.49,24.09 v1(18.38,23.21)
  Bottom Layer w0.254: v1(18.38,23.21) v1(24.98,23.21)
FSMC_D5: length 44.7
  Top Layer w0.254: v1(20.54,21.3) 20.54,21.94 17.87,24.6 17.87,30.57 19.15,31.85 U14.39 ; U7.23 26.88,14.7 29.2,12.39 32.71,12.39 33.75,13.43 v1(33.75,17.11)
  Bottom Layer w0.254: v1(20.54,21.3) 22.06,19.78 29.43,19.78 32.1,17.11 v1(33.75,17.11)
FSMC_D6: length 21.1
  Top Layer w0.254: U14.40 19.92,31.35 18.51,29.94 18.51,24.73 20.6,22.63 24.92,22.63 26.59,20.97 U7.22
FSMC_D7: length 48.1
  Top Layer w0.254: U7.21 26.28,14.67 28.92,12.03 32.99,12.03 34.13,13.17 34.13,16.35 34.51,16.73 v1(34.51,17.36) ; v1(19.52,29.81) 20.56,30.85 U14.41
  Bottom Layer w0.254: v1(34.51,17.36) 34.13,17.75 31.97,17.75 29.43,20.28 22.7,20.28 20.92,22.06 18.38,22.06 16.98,23.46 16.98,29.17 17.62,29.81 v1(19.52,29.81)
FSMC_NE1: length 32.7
  Top Layer w0.254: v1(40.35,32.35) U14.88 ; v1(30.19,14.06) 29.68,14.06 28.69,15.06 U7.29
  Bottom Layer w0.254: v1(30.19,14.06) 35.14,14.06 41.62,20.54 41.62,31.33 40.6,32.35 v1(40.35,32.35)
FSMC_NOE: length 24.1
  Top Layer w0.254: U7.30 28.99,21.49 v1(28.79,21.68) ; v1(40.35,30.32) 39.82,30.85 U14.85
  Bottom Layer w0.254: v1(40.35,30.32) 40.6,30.06 40.6,23.84 38.45,21.68 v1(28.79,21.68)
FSMC_NWE: length 29.4
  Top Layer w0.254: U7.31 29.28,15.35 v1(29.81,14.82) ; v1(40.6,31.33) 40.59,31.35 U14.86
  Bottom Layer w0.254: v1(40.6,31.33) 41.11,30.83 41.11,20.79 35.14,14.82 v1(29.81,14.82)
LCD_RESET: length 43.6
  Top Layer w0.254: v1(37.05,14.06) 34.64,11.65 28.67,11.65 25.69,14.63 U7.19 ; v1(39.72,36.29) 39.65,36.35 U14.96
  Bottom Layer w0.254: v1(37.05,14.06) 43.02,20.03 43.02,32.98 v1(39.72,36.29)
LED: length 29
  Top Layer w0.254: v1(42.51,17.87) 42.29,17.66 LED1.1 ; U14.98 39.4,37.35 41.48,35.27 43.78,35.27 44.29,35.78 45.3,35.78 v1(45.43,35.65)
  Bottom Layer w0.254: v1(42.51,17.87) 45.43,20.79 v1(45.43,35.65)
LEDK: length 5.1
  Top Layer w0.254: R25.2 21.42,10.38 25.25,10.38 Q1.3
OSCIN: length 20.6
  Top Layer w0.254: U14.12 30.82,43.01 32.35,44.54 X2.1 36.93,46.65 C4.1 33.58,50 R5.1
OSCOUT: length 14.6
  Top Layer w0.254: R5.2 28.17,48.98 28.79,48.35 C5.1 30.51,47.02 X2.2 29.05,44.54 30.32,43.27 U14.13
PULSE: length 20.7
  Top Layer w0.254: U14.71 34.32,20.48 37.81,16.98 37.81,13.05 34.38,9.62 R24.2
RESET: length 14.3
  Top Layer w0.254: C3.2 24.51,48.45 R3.1 24.98,47.98 24.98,43.27 25.49,42.76 27.65,42.76 28.54,41.88 29.18,41.88 29.82,41.23 U14.14
RXD1: length 10.1
  Top Layer w0.254: U18.7 44.85,29.12 43.65,30.32 43.65,30.82 39.62,34.85 U14.93
SDIO_CK: length 18.7
  Top Layer w0.254: v1(35.02,29.05) 35.91,29.05 36.6,28.35 U14.80
  Bottom Layer w0.254: CARD1.5 23.85,33.24 24.73,34.13 28.92,34.13 32.35,30.7 34.25,30.7 35.02,29.94 v1(35.02,29.05)
SDIO_CMD: length 20.1
  Top Layer w0.254: v1(34,29.94) 34.09,29.85 U14.83
  Bottom Layer w0.254: R29.1 23.83,27.26 26.05,29.47 CARD1.3 26.05,32.65 26.89,33.49 28.92,33.49 32.48,29.94 v1(34,29.94)
SDIO_D0: length 39.2
  Top Layer w0.254: U14.65 31.32,34.87 v1(31.46,35.02)
  Bottom Layer w0.254: R28.1 21.65,27.42 CARD1.7 21.65,35.18 21.17,35.65 17.62,35.65 17.24,36.03 17.24,36.8 17.75,37.3 29.18,37.3 v1(31.46,35.02)
SDIO_D1: length 42.4
  Top Layer w0.254: U14.66 31.82,34.23 v1(32.22,34.64)
  Bottom Layer w0.254: v1(32.22,34.64) 32.22,35.53 29.94,37.81 16.98,37.81 16.22,37.05 16.22,36.03 17.24,35.02 20.67,35.02 21.05,34.64 21.05,33.49 20.55,32.99 CARD1.8 20.55,27.9 R19.1
SDIO_D2: length 16.4
  Top Layer w0.254: v1(35.4,27.4) 35.44,27.35 U14.78
  Bottom Layer w0.254: R31.1 28.25,27.98 CARD1.1 28.89,31.88 33.37,27.4 v1(35.4,27.4)
SDIO_D3: length 19.2
  Top Layer w0.254: v1(34.76,28.16) 35.53,28.16 35.83,27.85 U14.79
  Bottom Layer w0.254: R30.1 25.62,27.4 27.15,28.92 CARD1.2 27.15,32.73 27.52,33.11 28.55,33.11 33.51,28.16 v1(34.76,28.16)
SWDCLK: length 7.9
  Top Layer w0.254: U14.76 41.53,26.35 42.5,25.38 U18.4
SWDIO: length 12.6
  Top Layer w0.254: U14.72 34.82,25.8 35.27,26.25 36.29,26.25 38.42,24.12 U18.3
TXD1: length 11.2
  Top Layer w0.254: U14.92 39.49,34.35 43.15,30.7 43.15,28.92 44.19,27.88 U18.6
$1N1305: length 23.5
  Top Layer w0.254: v1(46.32,35.78) 46.69,36.15 R4.1 ; 43.89,16.6 44.03,16.74 v1(44.03,17.75)
  Bottom Layer w0.254: v1(46.32,35.78) 46.32,20.03 v1(44.03,17.75)
$1N2733: length 23
  Top Layer w0.254: 18.65,4.03 18.65,4.52 v1(17.87,5.3)
  Bottom Layer w0.254: R8.1 11.14,23.6 11.14,20.28 14.44,16.98 14.44,8.73 v1(17.87,5.3)
$1N2766: length 21.4
  Top Layer w0.254: v1(16.73,5.04) 17.05,4.73 CHARGING1.1
  Bottom Layer w0.254: v1(16.73,5.04) 16.6,5.04 13.81,7.84 13.81,12.16 12.66,13.3 8.35,13.3 6.57,15.08 6.57,17.65 U2.1
$1N2908: length 11.7
  Top Layer w0.254: U12.1 13.31,27.67 12.66,27.03 v1(12.66,25.49)
  Bottom Layer w0.254: v1(12.66,25.49) 12.03,24.86 9.9,24.86 9.87,24.82 ; R6.2 9.87,24.82 ; 9.87,24.82 9.87,23.85 ; 9.87,23.85 R8.2 ; 9.87,23.85 9.87,20.25 U2.4
$1N3037: length 2.8
  Bottom Layer w0.254: R9.2 9.76,16.26 U2.5
$1N19149: length 4.3
  Top Layer w0.254: R14.2 41.37,34.25 40.27,35.35 U14.94
$1N19191: length 4.6
  Top Layer w0.254: U14.37 19.4,32.85 18.89,33.37 R15.1
$1N25426: length 3.3
  Top Layer w0.254: R27.1 14.45,18.9 POWER1.2
$2N2334: length 10.6
  Top Layer w0.254: U7.2 19.6,19.6 18.76,18.76 18.76,13.04 R25.1
$2N7890: length 10.7
  Bottom Layer w0.254: U15.3 15.19,34.65 BUZZER2.2 13.78,36.03 12.41,36.03 11.52,36.92 11.52,38.02 D1.1
$2N7891: length 9
  Bottom Layer w0.254: U15.1 12.85,36.86 12.03,37.68 12.03,40.74 R22.1 R23.1
$2N9800: length 2.8
  Top Layer w0.254: R24.1 30.14,9.56 Q1.1
$2N9887: length 6.3
  Top Layer w0.254: R26.1 22.7,11.65 20.88,13.46 U7.3

Small or netless copper shapes (teardrops, artwork), in the pictures only: 247 on Top Layer, 163 on Bottom Layer

## Text on the board
Bottom Silkscreen Layer: IN+ | IN- | OUT+ | OUT- | BAT -  +
Top Silkscreen Layer: design:lxr / 2024.5.20 | 5  3 IO CLK  G  T  R  G | G B A S | 开  关
